# Altium schematic sheet BluetoothSchematic.SchDoc
size A3; SheetNumber: 1; SheetTotal: 1
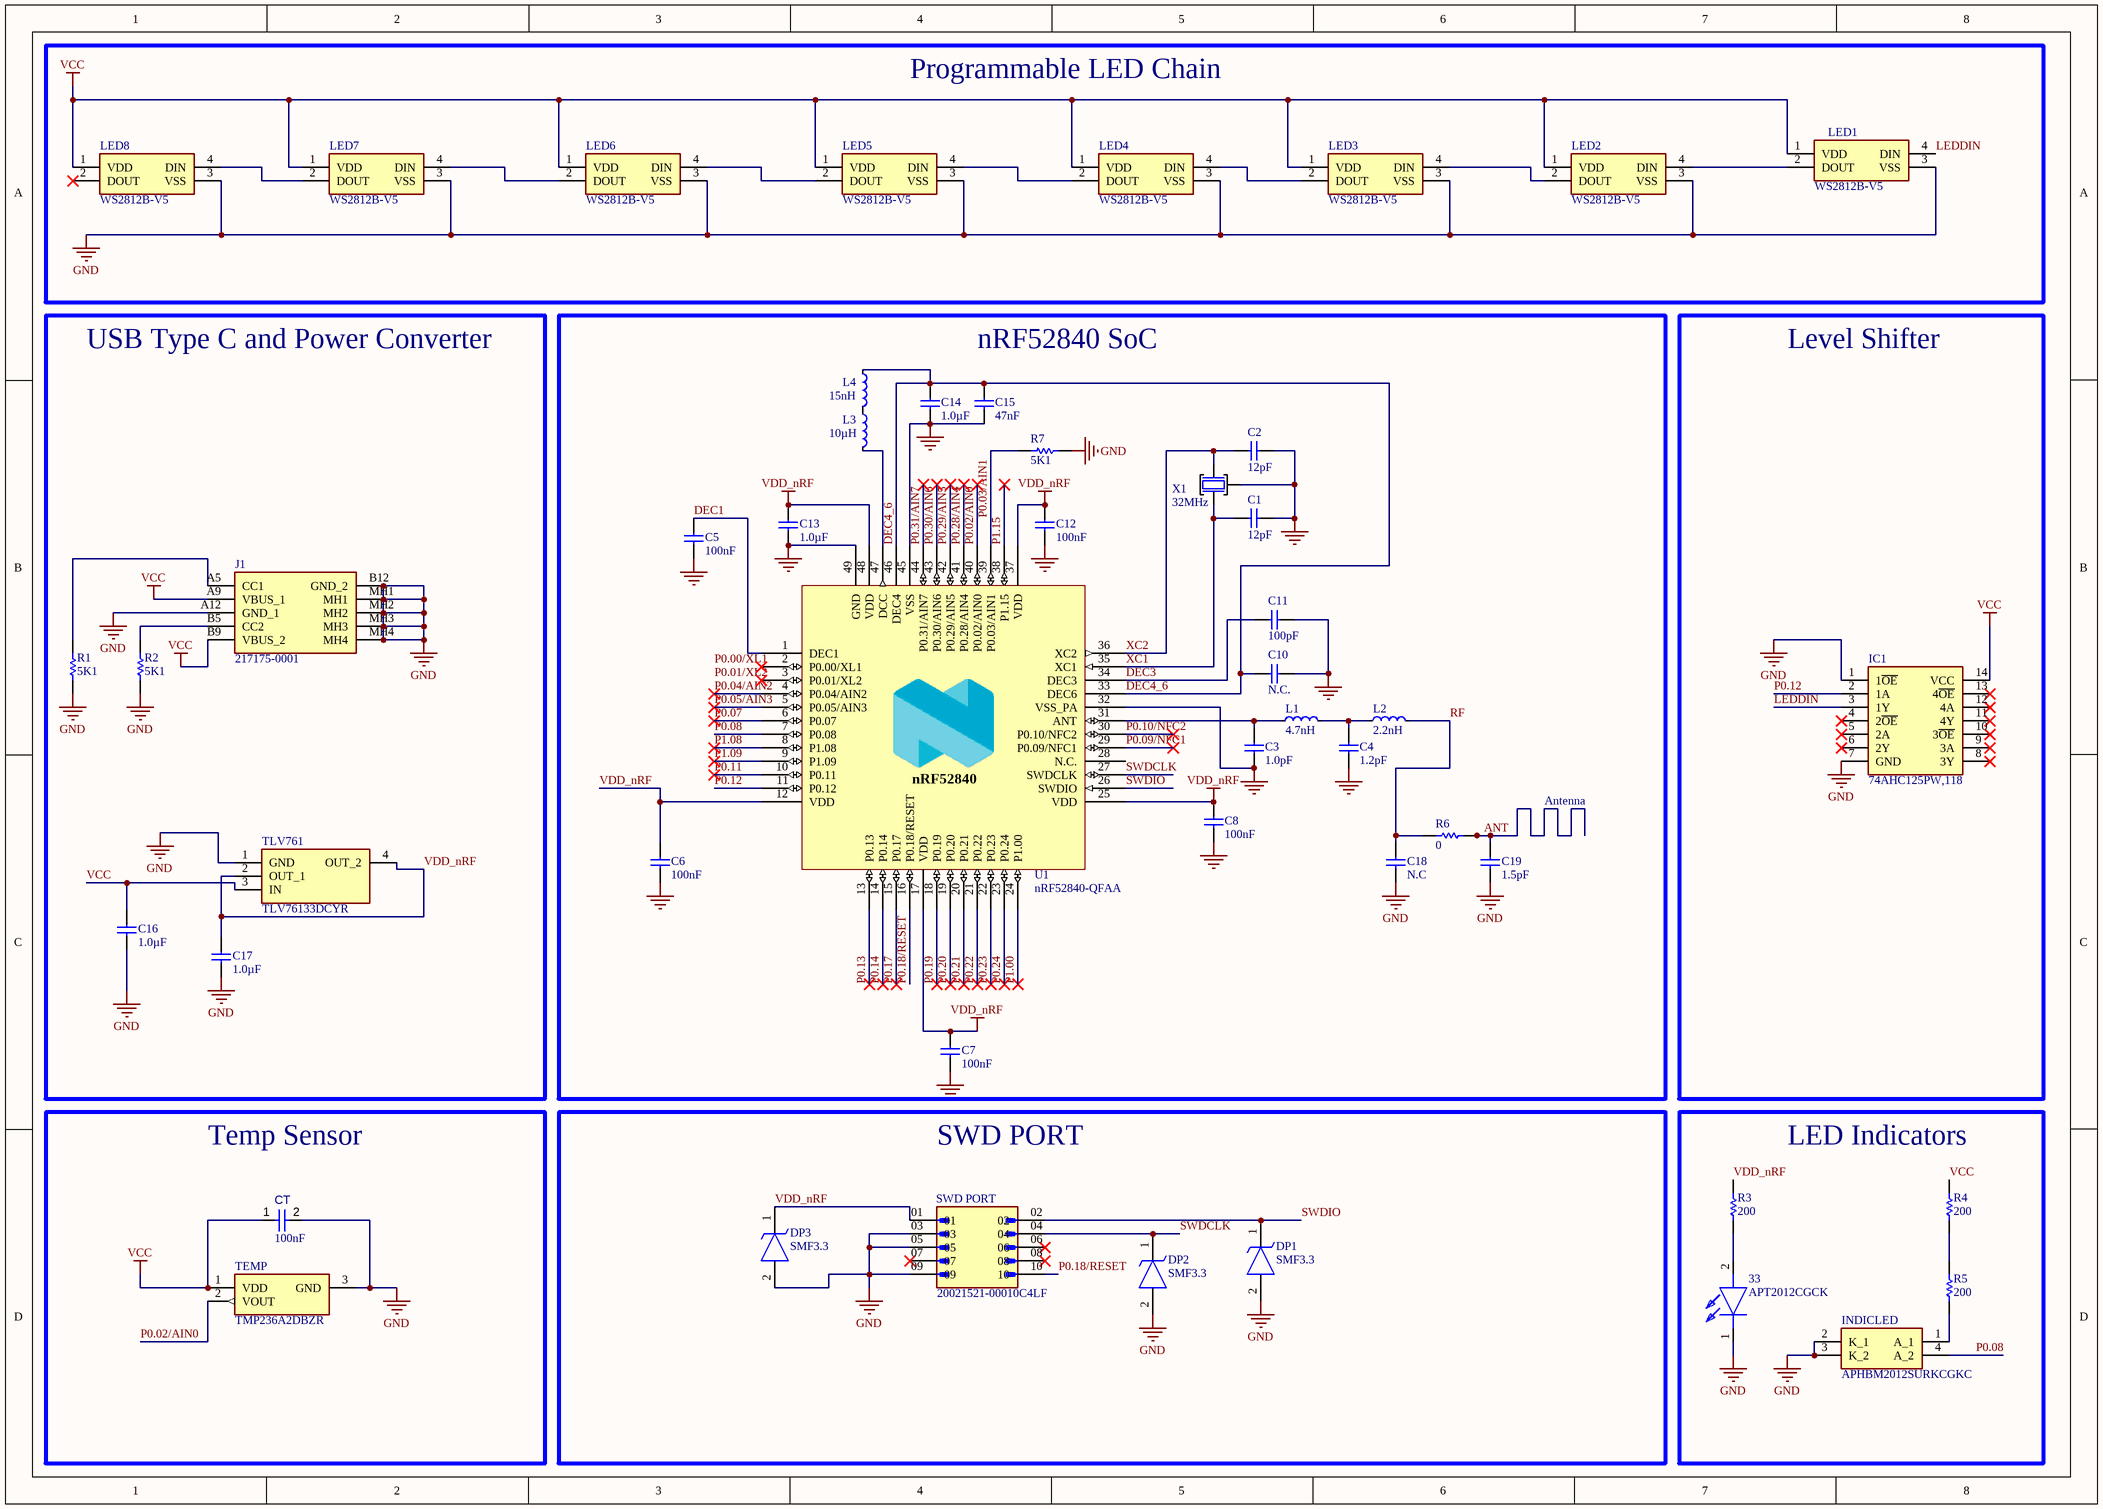
[diagram p0: BluetoothSchematic.SchDoc]

## Parts
33  APT2012CGCK  [LEDC2012X50N]
C1  12pF  [CAPC0603X03L_C]
C2  12pF  [CAPC0603X03L_C]
C3  1.0pF  [CAPC0603X03L_C]
C4  1.2pF  [CAPC0603X03L_C]
C5  100nF  [CAPC0603X03L_C]
C6  100nF  [CAPC0603X03L_C]
C7  100nF  [CAPC0603X03L_C]
C8  100nF  [CAPC0603X03L_C]
C10  N.C.  [CAPC0603X03L_C_NC]
C11  100pF  [CAPC0603X03L_C]
C12  100nF  [CAPC0603X03L_C]
C13  1.0µF  [CAPC1005X04L]
C14  1.0µF  [CAPC1005X04L]
C15  47nF  [CAPC0603X03L_C]
C16  1.0µF  [CAPC1005X04L]
C17  1.0µF  [CAPC1005X04L]
C18  N.C  [CAPC0603X03L_C]
C19  1.5pF  [CAPC0603X03L_C]
CT  value 100nF  [CAPC1608X90X40NL10T20]  (hidden comment: Capacitor 100 nF +/-10% 50 V 0603)
DP1  SMF3.3  [SOD3718X108N]
DP2  SMF3.3  [SOD3718X108N]
DP3  SMF3.3  [SOD3718X108N]
IC1  74AHC125PW,118  [SOP65P640X110-14N]
INDICLED  APHBM2012SURKCGKC  [APHBM2012SURKCGKC]
J1  217175-0001  [2171750001]
L1  4.7nH  [INDC0603X03L_C]
L2  2.2nH  [INDC0603X03L_C]
L3  10µH  [INDC1608X06L]
L4  15nH  [INDC1005X04L]
LED1  WS2812B-V5  [WS2812BV5]
LED2  WS2812B-V5  [WS2812BV5]
LED3  WS2812B-V5  [WS2812BV5]
LED4  WS2812B-V5  [WS2812BV5]
LED5  WS2812B-V5  [WS2812BV5]
LED6  WS2812B-V5  [WS2812BV5]
LED7  WS2812B-V5  [WS2812BV5]
LED8  WS2812B-V5  [WS2812BV5]
R1  value 5K1  [RESC3116X70X50ML13T20]  (hidden comment: Resistor 0R +/- 0.05% 1206 250 mW)
R2  value 5K1  [RESC3116X70X50ML13T20]  (hidden comment: Resistor 0R +/- 0.05% 1206 250 mW)
R3  value 200  [RESC3116X70X50ML13T20]  (hidden comment: Resistor 0R +/- 0.05% 1206 250 mW)
R4  value 200  [RESC3116X70X50ML13T20]  (hidden comment: Resistor 0R +/- 0.05% 1206 250 mW)
R5  value 200  [RESC3116X70X50ML13T20]  (hidden comment: Resistor 0R +/- 0.05% 1206 250 mW)
R6  value 0  [RESC1608X55X25ML10T15]  (hidden comment: Resistor 0R +/- 5% 0603 100 mW)
R7  value 5K1  [RESC3116X70X50ML13T20]  (hidden comment: Resistor 0R +/- 0.05% 1206 250 mW)
SWD_PORT  20021521-00010C4LF  [AMPHENOL_20021521-00010C4LF]
TEMP  TMP236A2DBZR  [SOT95P237X112-3N]
TLV761  TLV76133DCYR  [SOT230P700X180-4N]
U1  nRF52840-QFAA  [QFN40P600X600X90-48N]
X1  32MHz  [XTAL_2016_NT]

## Blocks framed on the sheet
Programmable LED Chain: LED1-LED8
USB Type C and Power Converter: C16 C17 J1 R1 R2 TLV761
nRF52840 SoC: C1-C8 C10-C15 C18 C19 L1-L4 R6 R7 U1 X1
Level Shifter: IC1
Temp Sensor: CT TEMP
SWD PORT: DP1-DP3 SWD_PORT
LED Indicators: 33 INDICLED R3-R5

## Nets
GND: 33.1(K) C1.2 C2.2 C3.1 C4.1 C5.2 C6.2 C7.2 C8.2 C10.1 C11.2 C12.2 C13.2 C14.1 C15.2 C16.2 C17.2 C18.1 C19.1 CT.2 DP1.2(A) DP2.2(A) DP3.2(A) IC1.1(1~{OE}) IC1.7(GND) INDICLED.2(K_1) INDICLED.3(K_2) J1.A12(GND_1) J1.B12(GND_2) J1.MH1 J1.MH2 J1.MH3 J1.MH4 LED1.3(VSS) LED2.3(VSS) LED3.3(VSS) LED4.3(VSS) LED5.3(VSS) LED6.3(VSS) LED7.3(VSS) LED8.3(VSS) R1.2 R2.2 R7.2 SWD_PORT.03 SWD_PORT.05 SWD_PORT.09 TEMP.3(GND) TLV761.1(GND) U1.32(VSS_PA) U1.45(VSS) U1.49(GND) X1.2(GND)
VCC: C16.1 CT.1 IC1.14(VCC) J1.A9(VBUS_1) J1.B9(VBUS_2) LED1.1(VDD) LED2.1(VDD) LED3.1(VDD) LED4.1(VDD) LED5.1(VDD) LED6.1(VDD) LED7.1(VDD) LED8.1(VDD) R4.1 TEMP.1(VDD) TLV761.3(IN)
VDD_nRF: C6.1 C7.1 C8.1 C12.1 C13.1 C17.1 DP3.1(K) R3.1 SWD_PORT.01 TLV761.2(OUT_1) TLV761.4(OUT_2) U1.12(VDD) U1.17(VDD) U1.25(VDD) U1.37(VDD) U1.48(VDD)
ANT: C19.2 R6.2
DEC1: C5.1 U1.1(DEC1)
DEC3: C11.1 U1.34(DEC3)
DEC4_6: C10.2 C14.2 C15.1 L4.1 U1.33(DEC6) U1.46(DEC4)
LEDDIN: IC1.3(1Y) LED1.4(DIN)
P0.02/AIN0: TEMP.2(VOUT) U1.40(P0.02/AIN0)
P0.03/AIN1: R7.1 U1.39(P0.03/AIN1)
P0.04/AIN2: U1.4(P0.04/AIN2)
P0.05/AIN3: U1.5(P0.05/AIN3)
P0.07: U1.6(P0.07)
P0.08: INDICLED.4(A_2) U1.7(P0.08)
P0.09/NFC1: U1.29(P0.09/NFC1)
P0.10/NFC2: U1.30(P0.10/NFC2)
P0.11: U1.10(P0.11)
P0.12: IC1.2(1A) U1.11(P0.12)
P0.13: U1.13(P0.13)
P0.14: U1.14(P0.14)
P0.17: U1.15(P0.17)
P0.18/RESET: SWD_PORT.10 U1.16(P0.18/RESET)
P0.19: U1.18(P0.19)
P0.20: U1.19(P0.20)
P0.21: U1.20(P0.21)
P0.22: U1.21(P0.22)
P0.23: U1.22(P0.23)
P0.24: U1.23(P0.24)
P0.28/AIN4: U1.41(P0.28/AIN4)
P0.29/AIN5: U1.42(P0.29/AIN5)
P0.30/AIN6: U1.43(P0.30/AIN6)
P0.31/AIN7: U1.44(P0.31/AIN7)
P1.00: U1.24(P1.00)
P1.08: U1.8(P1.08)
P1.09: U1.9(P1.09)
P1.15: U1.38(P1.15)
RF: C18.2 L2.2 R6.1
SWDCLK: DP2.1(K) SWD_PORT.04 U1.27(SWDCLK)
SWDIO: DP1.1(K) SWD_PORT.02 U1.26(SWDIO)
XC1: C1.1 U1.35(XC1) X1.1(IN)
XC2: C2.1 U1.36(XC2) X1.3(OUT)
Net33_2: 33.2(A) R3.2
NetC3_2: C3.2 L1.1 U1.31(ANT)
NetC4_2: C4.2 L1.2 L2.1
NetINDICLED_1: INDICLED.1(A_1) R5.2
NetJ1_A5: J1.A5(CC1) R1.1
NetJ1_B5: J1.B5(CC2) R2.1
NetL3_1: L3.1 L4.2
NetL3_2: L3.2 U1.47(DCC)
NetLED1_2: LED1.2(DOUT) LED2.4(DIN)
NetLED2_2: LED2.2(DOUT) LED3.4(DIN)
NetLED3_2: LED3.2(DOUT) LED4.4(DIN)
NetLED4_2: LED4.2(DOUT) LED5.4(DIN)
NetLED5_2: LED5.2(DOUT) LED6.4(DIN)
NetLED6_2: LED6.2(DOUT) LED7.4(DIN)
NetLED7_2: LED7.2(DOUT) LED8.4(DIN)
NetR4_2: R4.2 R5.1

Not connected (* = marked no-connect by the designer): IC1 4(2~{OE})* 5(2A)* 6(2Y)* 8(3Y)* 9(3A)* 10(3~{OE})* 11(4Y)* 12(4A)* 13(4~{OE})*; LED8 2(DOUT)*; SWD_PORT 06* 07* 08*; U1 2(P0.00/XL1)* 3(P0.01/XL2)* 28(N.C.)

## Notes on the sheet
- Antenna
- Labels drawn without touching a wire or pin: P0.00/XL1, P0.01/XL2
- (in symbol nRF52840-QFAA) nRF52840

## Library data of the parts
33 = APT2012CGCK: LED; Manufacturer_Name: Kingbright; Datasheet Link: https://componentsearchengine.com/Datasheets/1/APT2012CGCK.pdf; Height: 0.5mm; Manufacturer_Part_Number: APT2012CGCK; Mouser Part Number: 604-APT2012CGCK; Mouser Price/Stock: https://www.mouser.co.uk/ProductDetail/Kingbright/APT2012CGCK?qs=VdjlWU%2FzoOEv1TxC2gMNzg%3D%3D; Arrow Part Number: APT2012CGCK; Arrow Price/Stock: https://www.arrow.com/en/products/apt2012cgck/kingbright
C1 C2 = C0201-12p: Capacitor, NP0, ±2%; Pad Count: 2; Part Number: C0201-12p; LatestRevisionDate: 2017-11-09; Published: 2014-11-13; Value: 12pF; Footprint Doc: 0201; Component Class: Capacitors
C3 = C0201-1.0p: Capacitor, NP0, ±10%; Pad Count: 2; Part Number: C0201-1.0p; LatestRevisionDate: 2018-10-22; Published: 2014-11-13; Value: 1.0pF; Footprint Doc: 0201; Component Class: Capacitors
C4 = C0201-1.2p: Capacitor, NP0, ±10%; Pad Count: 2; Part Number: C0201-1.2p; LatestRevisionDate: 2020-10-13; Published: 2014-11-13; Value: 1.2pF; Footprint Doc: 0201; Component Class: Capacitors
C5-C8 C12 = C0201-100n: Capacitor, X5R, ±10%; Pad Count: 2; Part Number: C0201-100n; LatestRevisionDate: 2017-11-09; Published: 2014-11-13; Value: 100nF; Footprint Doc: 0201; Component Class: Capacitors
C10 = C0201-N.C.: Not mounted; Assembly: Not mounted; Pad Count: 2; Part Number: C0201-N.C.; LatestRevisionDate: 2014-11-13; Published: 2014-11-13; Value: N.C.; Footprint Doc: 0201; Component Class: Capacitors
C11 = C0201-100p: Capacitor, NP0, ±5%; Pad Count: 2; Part Number: C0201-100p; LatestRevisionDate: 2019-04-16; Published: 2019-04-16; Value: 100pF; Footprint Doc: 0201; Component Class: Capacitors
C13 C14 C16 C17 = C0402-1µ0: Capacitor, X5R, ±10%; Pad Count: 2; Part Number: C0402-1µ0; LatestRevisionDate: 2016-08-22; Published: 2009-05-08; Value: 1.0µF; Footprint Doc: 0402; Component Class: Capacitors
C15 = C0201-47n: Capacitor, X5R, ±10%; Pad Count: 2; Part Number: C0201-47n; LatestRevisionDate: 2017-11-09; Published: 2014-11-13; Value: 47nF; Footprint Doc: 0201; Component Class: Capacitors
C18 C19 = C0201-1.2p: Capacitor, NP0, ±10%; Value: 1.2pF; Pad Count: 2; Part Number: C0201-1.2p; LatestRevisionDate: 2020-10-13; Published: 2014-11-13; Footprint Doc: 0201; Component Class: Capacitors
CT = CMP-001-00017-6: Chip Capacitor, 100 nF, +/- 10%, 50 V, 0603 (1608 Metric); Voltage Rating: 50V; Capacitor Type: Ceramic; Tolerance: 10%; Mounting Technology: SM; Max Operating Temperature: 125°C; RoHS Compliant: True; Pins: 2; Case/Package: 0603; Min Operating Temperature: -55°C
DP1-DP3 = SMF3.3: TVS Diode (Uni-directional); Manufacturer_Name: LITTELFUSE; Datasheet Link: https://componentsearchengine.com/Datasheets/2/SMF3.3.pdf; Height: 1.08mm; Manufacturer_Part_Number: SMF3.3; Mouser Part Number: 576-SMF3.3; Mouser Price/Stock: https://www.mouser.co.uk/ProductDetail/Littelfuse/SMF3.3?qs=5LChGqRbrjutbyo%2F8EojOg%3D%3D; Arrow Part Number: SMF3.3; Arrow Price/Stock: https://www.arrow.com/en/products/smf3.3/littelfuse?region=nac
IC1 = 74AHC125PW,118: Integrated Circuit; Manufacturer_Name: Nexperia; Datasheet Link: https://assets.nexperia.com/documents/data-sheet/74AHC_AHCT125.pdf; Height: 1.1mm; Manufacturer_Part_Number: 74AHC125PW,118; Mouser Part Number: 771-AHC125PW118; Mouser Price/Stock: https://www.mouser.co.uk/ProductDetail/Nexperia/74AHC125PW118?qs=P62ublwmbi8wF1xkzo8GYw%3D%3D; Arrow Part Number: 74AHC125PW,118; Arrow Price/Stock: https://www.arrow.com/en/products/74ahc125pw118/nexperia?region=nac
INDICLED = APHBM2012SURKCGKC: LED; Manufacturer_Name: Kingbright; Datasheet Link: https://mouser.componentsearchengine.com/Datasheets/3/APHBM2012SURKCGKC.pdf; Height: 0.45mm; Manufacturer_Part_Number: APHBM2012SURKCGKC; Mouser Part Number: 604-BM2012SURKCGKC; Mouser Price/Stock: https://www.mouser.co.uk/ProductDetail/Kingbright/APHBM2012SURKCGKC?qs=mWUXtl%252BhaIKZSpp3TSJ%2FQA%3D%3D; Arrow Part Number: APHBM2012SURKCGKC; Arrow Price/Stock: https://www.arrow.com/en/products/aphbm2012surkcgkc/kingbright?region=nac
J1 = 217175-0001: Connector; Manufacturer_Name: Molex; Datasheet Link: https://www.molex.com/pdm_docs/sd/2171750001_sd.pdf; Height: 3.46mm; Manufacturer_Part_Number: 217175-0001; Mouser Part Number: 538-217175-0001; Mouser Price/Stock: https://www.mouser.co.uk/ProductDetail/Molex/217175-0001?qs=DRkmTr78QARWJMiqNnldSg%3D%3D
L1 = L0201-4n7: High frequency chip inductor ±5%; Pad Count: 2; Part Number: L0201-4n7; LatestRevisionDate: 2013-04-10; Published: 2013-04-10; Value: 4.7nH; Footprint Doc: 0201; Component Class: Inductors
L2 = L0201-2n2: High frequency chip inductor ±5%; Pad Count: 2; Part Number: L0201-2n2; LatestRevisionDate: 2013-04-10; Published: 2013-04-10; Value: 2.2nH; Footprint Doc: 0201; Component Class: Inductors
L3 = L0603-10µ-TDK: Chip inductor, IDC,min = 50 mA, ±20%; Pad Count: 2; Part Number: L0603-10µ-TDK; LatestRevisionDate: 2012-09-19; Published: 2019-05-06; Value: 10µH; Footprint Doc: 0603; Component Class: Inductors
L4 = L0402-15n: High frequency chip inductor ±10%; Pad Count: 2; Part Number: L0402-15n; LatestRevisionDate: 2012-09-19; Published: 2010-07-12; Value: 15nH; Footprint Doc: 0402; Component Class: Inductors
LED1-LED8 = WS2812B-V5: LED; Manufacturer_Name: Worldsemi; Datasheet Link: https://www.tme.com/Document/64e8d425b90f84990264129a9679149c/WS2812B-V5.pdf; Height: 1.62mm; Manufacturer_Part_Number: WS2812B-V5
R1-R5 R7 = CMP-009-00008-5: Chip Resistor, 0 Ohm, 0.25 W, -55 to 155 degC, 1206 (3216 Metric); Voltage Rating: 200V; Power: 250mW; Pins: 2; Min Operating Temperature: -55°C; Tolerance: 0.05%; RoHS Compliant: True; Max Operating Temperature: 155°C; Mounting Technology: SM; Case/Package: 1206
R6 = CMP-009-00006-5: Chip Resistor, 0 Ohm, 0.1 W, -55 to 155 degC, 0603 (1608 Metric); Power: 100mW; Voltage Rating: 50V; Max Operating Temperature: 155°C; RoHS Compliant: True; Mounting Technology: SM; Case/Package: 0603; Min Operating Temperature: -55°C; Tolerance: 5%; Pins: 2
SWD_PORT = CMP-002-00073-1: Minitek127Â®, Shrouded Board to Board Header, Surface Mount, 10 positions, 1.27mm (0.500in) pitch.; MF: AMPHENOL ICC / FCI; Case/Package: None; Design Item ID: 20021521-00010C4LF; SnapEDA_Link: https://www.snapeda.com/parts/20021521-00010C4LF/Amphenol/view-part/?ref=snap; Check_prices: https://www.snapeda.com/parts/20021521-00010C4LF/Amphenol/view-part/?ref=eda; Component Type: Standard; Source: 20021521-00010C4LF.SchLib; Value: *; Pins: 10; Purchase-URL: https://pricing.snapeda.com/search/part/20021521-00010C4LF/?ref=eda; MP: 20021521-00010C4LF; Digi-Key_Part_Number: 609-6445-2-ND
TEMP = TMP236A2DBZR: Undefined or Miscellaneous; Manufacturer_Name: Texas Instruments; Datasheet Link: http://www.ti.com/lit/gpn/tmp236; Height: 1.12mm; Manufacturer_Part_Number: TMP236A2DBZR; Mouser Part Number: 595-TMP236A2DBZR; Mouser Price/Stock: https://www.mouser.co.uk/ProductDetail/Texas-Instruments/TMP236A2DBZR?qs=lc2O%252BfHJPVanftlPgPUvow%3D%3D; Arrow Part Number: TMP236A2DBZR; Arrow Price/Stock: https://www.arrow.com/en/products/tmp236a2dbzr/texas-instruments?region=nac
TLV761 = TLV76133DCYR: Integrated Circuit; Manufacturer_Name: Texas Instruments; Datasheet Link: https://www.ti.com/lit/ds/symlink/tlv761.pdf?ts=1679984111185&ref_url=https%253A%252F%252Fwww.ti.com%252Fsitesearch%252Fen-us%252Fdocs%252Funiversalsearch.tsp%253FlangPref%253Den-US%2526searchTerm%253DTLV76133DCYR%2526nr%253D2; Height: 1.8mm; Manufacturer_Part_Number: TLV76133DCYR; Mouser Part Number: 595-TLV76133DCYR; Mouser Price/Stock: https://www.mouser.co.uk/ProductDetail/Texas-Instruments/TLV76133DCYR?qs=9vOqFld9vZV5BPjUhjTZUA%3D%3D; Arrow Part Number: TLV76133DCYR; Arrow Price/Stock: https://www.arrow.com/en/products/tlv76133dcyr/texas-instruments?region=nac
U1 = nRF52840-QFAA: Multi-protocol Bluetooth Low Energy, IEEE 802.15.4, ANT and 2.4GHz proprietary system-on-chip; Pad Count: 48; Part Number: nRF52840-QFAA; LatestRevisionDate: 2016-11-22; Published: 2016-03-31; Value: nRF52840-QFAA; Footprint Doc: QFN-48; Component Class: nRF_Devices
X1 = XTAL_SMD2016_32MHz_8pF_General_NT: XTAL SMD 2016, 32MHz, Cl=8pF, Total Tol: ±30ppm; Pad Count: 4; Part Number: XTAL_SMD2016_32MHz_8pF_General_NT; LatestRevisionDate: 2021-04-08; Published: 2021-04-08; Value: 32MHz; Footprint Doc: XTAL_2016; Component Class: Oscillators